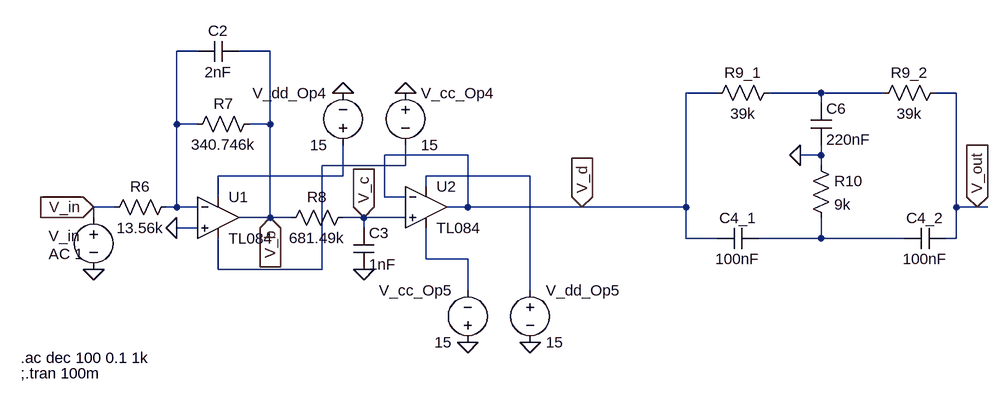
[diagram p0: schematic 1_c.asc]
1_c.asc, the LTspice schematic file:
Version 4
SHEET 1 1132 680
WIRE -160 -48 -192 -48
WIRE -48 -48 -96 -48
WIRE 640 16 592 16
WIRE 800 16 720 16
WIRE 896 16 800 16
WIRE 1008 16 976 16
WIRE 800 32 800 16
WIRE -192 64 -192 -48
WIRE -160 64 -192 64
WIRE -48 64 -48 -48
WIRE -48 64 -80 64
WIRE 256 112 128 112
WIRE 800 112 800 96
WIRE 800 112 768 112
WIRE 160 128 160 96
WIRE 160 128 32 128
WIRE 800 128 800 112
WIRE 64 144 64 96
WIRE 64 144 -128 144
WIRE 352 144 192 144
WIRE 192 160 192 144
WIRE -128 176 -128 144
WIRE 128 176 128 112
WIRE 160 176 128 176
WIRE -288 192 -320 192
WIRE -192 192 -192 64
WIRE -192 192 -208 192
WIRE -160 192 -192 192
WIRE 256 192 256 112
WIRE 256 192 224 192
WIRE 432 192 256 192
WIRE 592 192 592 16
WIRE 592 192 432 192
WIRE 1008 192 1008 16
WIRE 1040 192 1008 192
WIRE 1056 192 1040 192
WIRE -320 208 -320 192
WIRE -48 208 -48 64
WIRE -48 208 -96 208
WIRE -16 208 -48 208
WIRE 96 208 64 208
WIRE 160 208 96 208
WIRE -160 224 -192 224
WIRE 96 224 96 208
WIRE 592 240 592 192
WIRE 640 240 592 240
WIRE 800 240 800 208
WIRE 800 240 704 240
WIRE 928 240 800 240
WIRE 1008 240 1008 192
WIRE 1008 240 992 240
WIRE 192 272 192 224
WIRE 256 272 192 272
WIRE -128 288 -128 240
WIRE 32 288 32 128
WIRE 32 288 -128 288
WIRE 256 320 256 272
WIRE 352 320 352 144
FLAG -320 288 0
FLAG -192 224 0
FLAG 64 16 0
FLAG 160 16 0
FLAG 256 400 0
FLAG 352 400 0
FLAG 96 288 0
FLAG 768 112 0
FLAG 432 192 V_d
IOPIN 432 192 In
FLAG 96 208 V_c
IOPIN 96 208 In
FLAG -48 208 V_b
IOPIN -48 208 In
FLAG -320 192 V_in
IOPIN -320 192 In
FLAG 1040 192 V_out
IOPIN 1040 192 In
SYMBOL res 80 192 R90
WINDOW 0 0 56 VBottom 2
WINDOW 3 32 56 VTop 2
SYMATTR InstName R8
SYMATTR Value 681.49k
SYMBOL cap 80 224 R0
SYMATTR InstName C3
SYMATTR Value 1nF
SYMBOL res -192 176 R90
WINDOW 0 0 56 VBottom 2
WINDOW 3 32 56 VTop 2
SYMATTR InstName R6
SYMATTR Value 13.56k
SYMBOL res -64 48 R90
WINDOW 0 0 56 VBottom 2
WINDOW 3 32 56 VTop 2
SYMATTR InstName R7
SYMATTR Value 340.746k
SYMBOL cap -96 -64 R90
WINDOW 0 0 32 VBottom 2
WINDOW 3 32 32 VTop 2
SYMATTR InstName C2
SYMATTR Value 2nF
SYMBOL voltage -320 192 R0
WINDOW 0 -69 44 Left 2
WINDOW 3 -69 72 Left 2
WINDOW 123 -69 100 Left 2
WINDOW 39 0 0 Left 0
SYMATTR InstName V_in
SYMATTR Value AC 1
SYMBOL voltage 64 112 R180
WINDOW 0 24 96 Left 2
WINDOW 3 24 16 Left 2
SYMATTR InstName V_dd_Op4
SYMATTR Value 15
SYMBOL voltage 160 0 R0
WINDOW 123 0 0 Left 0
WINDOW 39 0 0 Left 0
SYMATTR InstName V_cc_Op4
SYMATTR Value 15
SYMBOL voltage 256 416 R180
WINDOW 0 24 96 Left 2
WINDOW 3 24 16 Left 2
WINDOW 123 0 0 Left 0
WINDOW 39 0 0 Left 0
SYMATTR InstName V_cc_Op5
SYMATTR Value 15
SYMBOL voltage 352 304 R0
WINDOW 123 0 0 Left 0
WINDOW 39 0 0 Left 0
SYMATTR InstName V_dd_Op5
SYMATTR Value 15
SYMBOL res 784 112 R0
SYMATTR InstName R10
SYMATTR Value 9k
SYMBOL res 736 0 R90
WINDOW 0 0 56 VBottom 2
WINDOW 3 32 56 VTop 2
SYMATTR InstName R9_1
SYMATTR Value 39k
SYMBOL res 992 0 R90
WINDOW 0 0 56 VBottom 2
WINDOW 3 32 56 VTop 2
SYMATTR InstName R9_2
SYMATTR Value 39k
SYMBOL cap 784 32 R0
SYMATTR InstName C6
SYMATTR Value 220nF
SYMBOL cap 704 224 R90
WINDOW 0 0 32 VBottom 2
WINDOW 3 32 32 VTop 2
SYMATTR InstName C4_1
SYMATTR Value 100nF
SYMBOL cap 992 224 R90
WINDOW 0 0 32 VBottom 2
WINDOW 3 32 32 VTop 2
SYMATTR InstName C4_2
SYMATTR Value 100nF
SYMBOL AutoGenerated\\TL084 -128 208 R0
SYMATTR InstName U1
SYMBOL AutoGenerated\\TL084 192 192 R0
SYMATTR InstName U2
TEXT -432 424 Left 2 !.ac dec 100 0.1 1k
TEXT -432 448 Left 2 !;.tran 100m

The netlist it stands for:
* 1_c.asc
R8 V_c V_b 681.49k
C3 V_c 0 1nF
R6 N001 V_in 13.56k
R7 V_b N001 340.746k
C2 V_b N001 2nF
V_in V_in 0 AC 1
V_dd_Op4 N004 0 15
V_cc_Op4 0 N003 15
V_cc_Op5 0 N007 15
V_dd_Op5 N005 0 15
R10 0 N006 9k
R9_1 N002 V_d 39k
R9_2 V_out N002 39k
C6 N002 0 220nF
C4_1 N006 V_d 100nF
C4_2 V_out N006 100nF
* U1: TL084 (symbol AutoGenerated\TL084 not available, pins judged from their places): In+=0 In-=N001 V+=N004 V-=N003 OUT=V_b
* U2: TL084 (symbol AutoGenerated\TL084 not available, pins judged from their places): In+=V_c In-=V_d V+=N005 V-=N007 OUT=V_d
.ac dec 100 0.1 1k
;.tran 100m
.backanno
.end